# Altium project LimeSDR-XTRX_1v1.PrjPcb (part 2 of 5)

## Sheet 07_LMS7002M_Power.SchDoc: LMS7002M power
size A3; Organization: Lime Microsystems; Address1: Surrey Tech Centre; Address2: Guildford GU2 7YG; Address3: Surrey; Address4: United Kingdom; Revision: v1.1; SheetNumber: 7; SheetTotal: 10
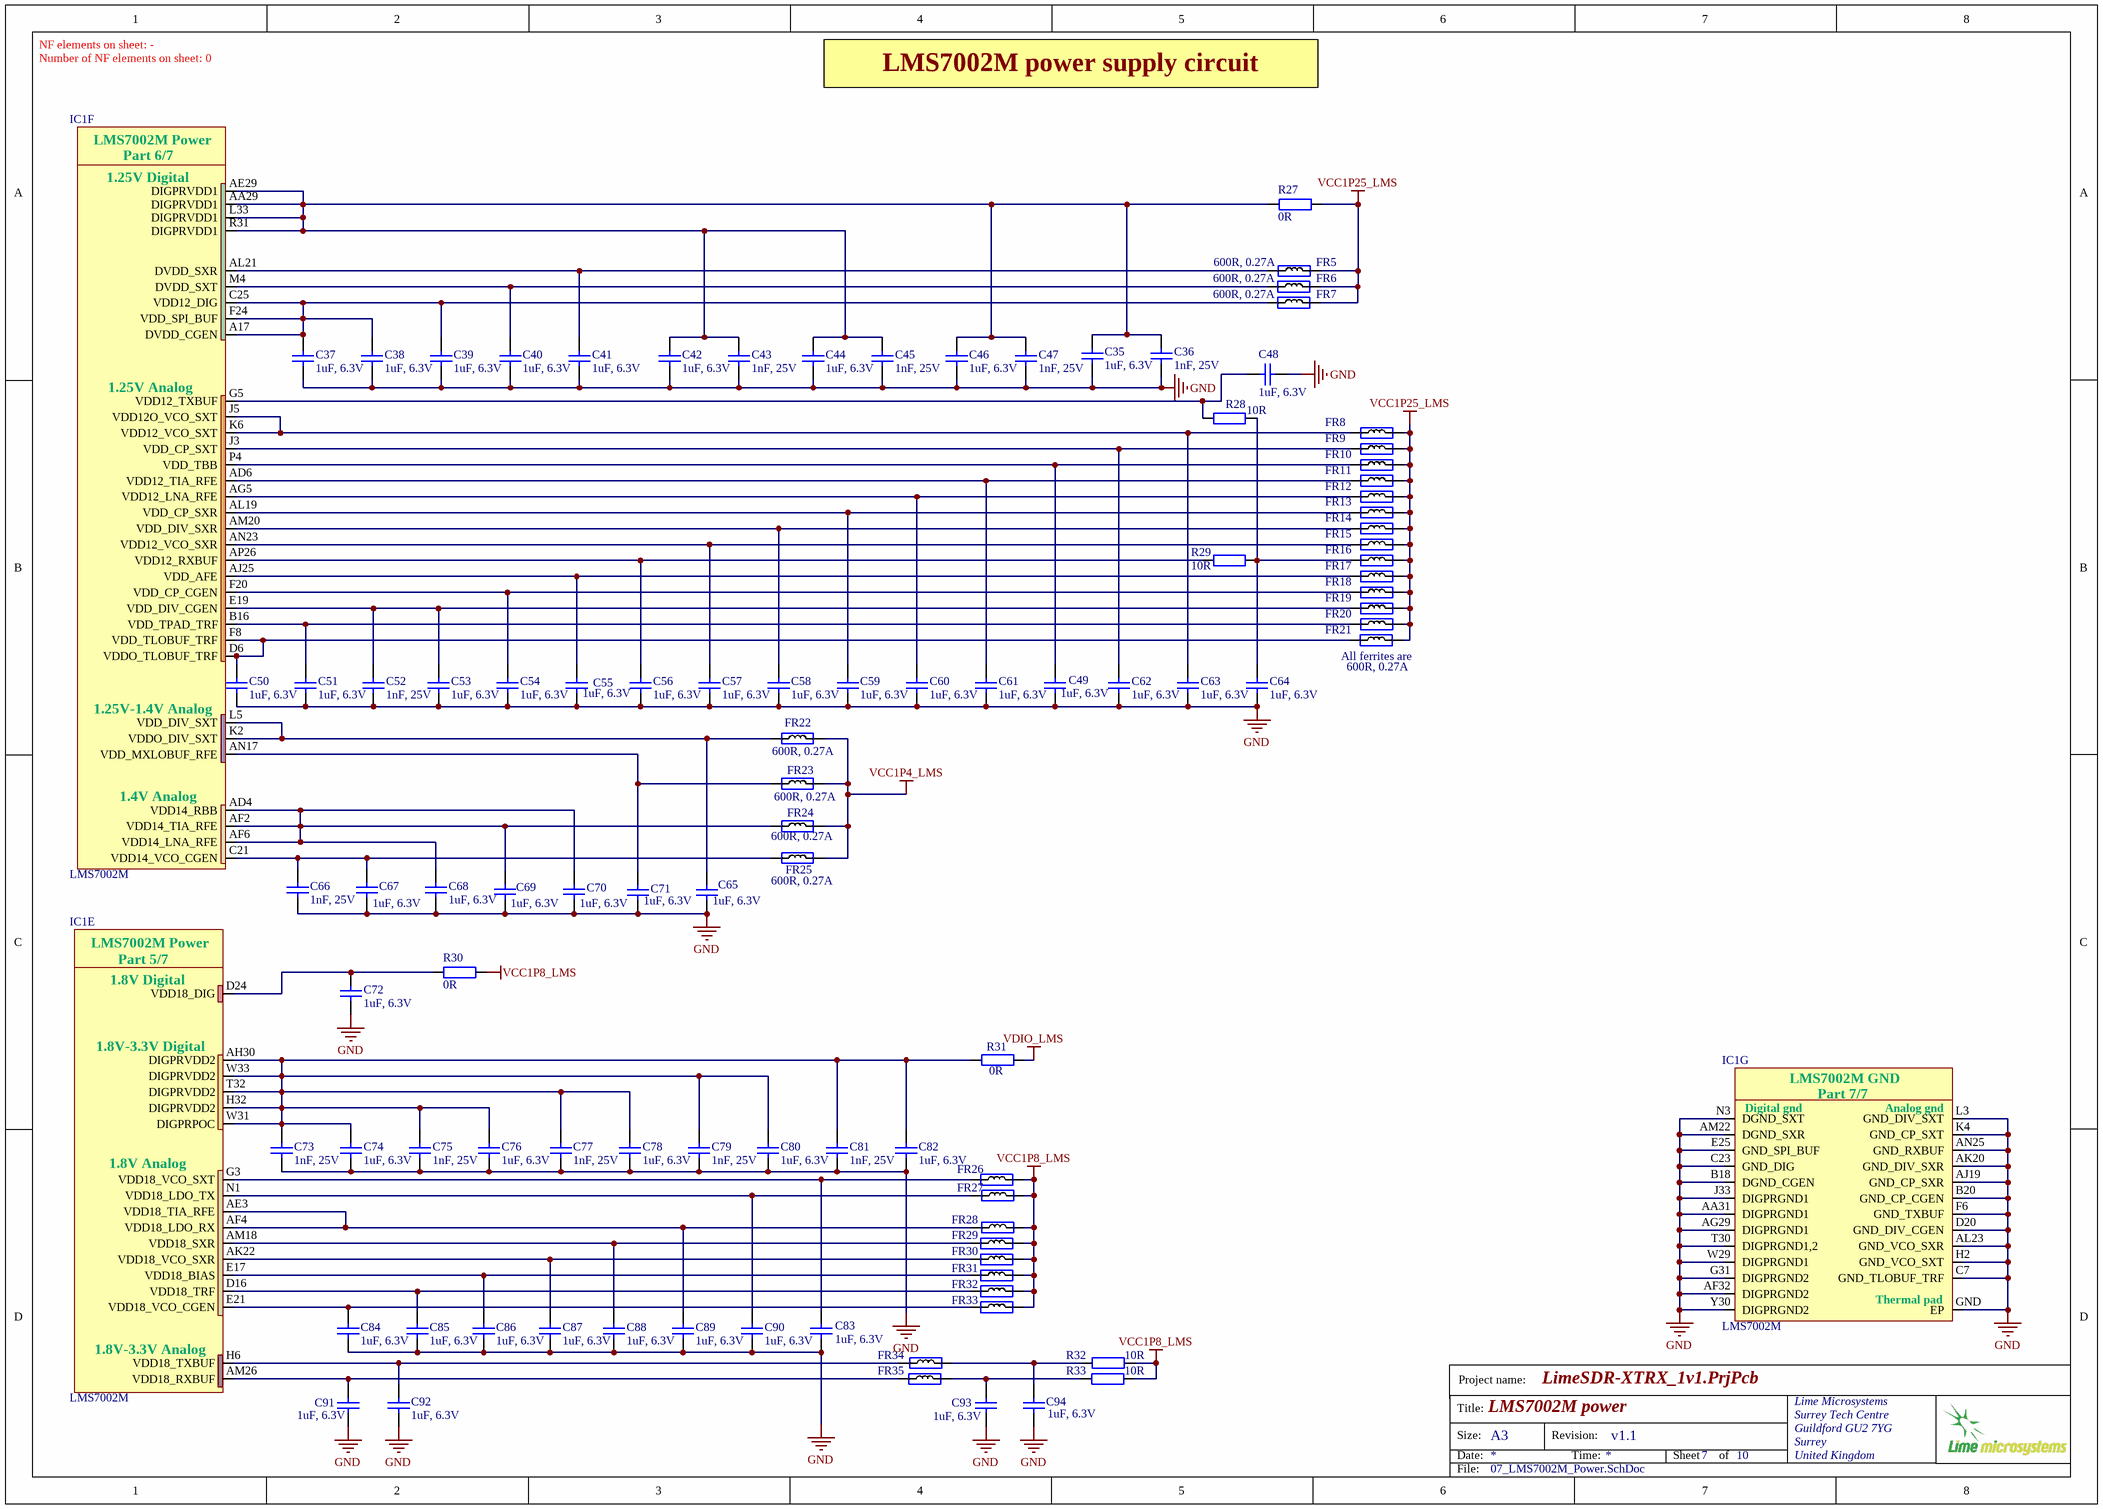
[diagram p4: 07_LMS7002M_Power.SchDoc]

### Parts
C35  1uF, 6.3V  [CAP0201]
C36  1nF, 25V  [CAP0201]
C37  1uF, 6.3V  [CAP0201]
C38  1uF, 6.3V  [CAP0201]
C39  1uF, 6.3V  [CAP0201]
C40  1uF, 6.3V  [CAP0201]
C41  1uF, 6.3V  [CAP0201]
C42  1uF, 6.3V  [CAP0201]
C43  1nF, 25V  [CAP0201]
C44  1uF, 6.3V  [CAP0201]
C45  1nF, 25V  [CAP0201]
C46  1uF, 6.3V  [CAP0201]
C47  1nF, 25V  [CAP0201]
C48  1uF, 6.3V  [CAP0201]
C49  1uF, 6.3V  [CAP0201]
C50  1uF, 6.3V  [CAP0201]
C51  1uF, 6.3V  [CAP0201]
C52  1nF, 25V  [CAP0201]
C53  1uF, 6.3V  [CAP0201]
C54  1uF, 6.3V  [CAP0201]
C55  1uF, 6.3V  [CAP0201]
C56  1uF, 6.3V  [CAP0201]
C57  1uF, 6.3V  [CAP0201]
C58  1uF, 6.3V  [CAP0201]
C59  1uF, 6.3V  [CAP0201]
C60  1uF, 6.3V  [CAP0201]
C61  1uF, 6.3V  [CAP0201]
C62  1uF, 6.3V  [CAP0201]
C63  1uF, 6.3V  [CAP0201]
C64  1uF, 6.3V  [CAP0201]
C65  1uF, 6.3V  [CAP0201]
C66  1nF, 25V  [CAP0201]
C67  1uF, 6.3V  [CAP0201]
C68  1uF, 6.3V  [CAP0201]
C69  1uF, 6.3V  [CAP0201]
C70  1uF, 6.3V  [CAP0201]
C71  1uF, 6.3V  [CAP0201]
C72  1uF, 6.3V  [CAP0201]
C73  1nF, 25V  [CAP0201]
C74  1uF, 6.3V  [CAP0201]
C75  1nF, 25V  [CAP0201]
C76  1uF, 6.3V  [CAP0201]
C77  1nF, 25V  [CAP0201]
C78  1uF, 6.3V  [CAP0201]
C79  1nF, 25V  [CAP0201]
C80  1uF, 6.3V  [CAP0201]
C81  1nF, 25V  [CAP0201]
C82  1uF, 6.3V  [CAP0201]
C83  1uF, 6.3V  [CAP0201]
C84  1uF, 6.3V  [CAP0201]
C85  1uF, 6.3V  [CAP0201]
C86  1uF, 6.3V  [CAP0201]
C87  1uF, 6.3V  [CAP0201]
C88  1uF, 6.3V  [CAP0201]
C89  1uF, 6.3V  [CAP0201]
C90  1uF, 6.3V  [CAP0201]
C91  1uF, 6.3V  [CAP0201]
C92  1uF, 6.3V  [CAP0201]
C93  1uF, 6.3V  [CAP0201]
C94  1uF, 6.3V  [CAP0201]
FR5  600R, 0.27A  [RES0201]
FR6  600R, 0.27A  [RES0201]
FR7  600R, 0.27A  [RES0201]
FR8  600R, 0.27A  [RES0201]
FR9  600R, 0.27A  [RES0201]  (value not drawn)
FR10  600R, 0.27A  [RES0201]  (value not drawn)
FR11  600R, 0.27A  [RES0201]  (value not drawn)
FR12  600R, 0.27A  [RES0201]  (value not drawn)
FR13  600R, 0.27A  [RES0201]  (value not drawn)
FR14  600R, 0.27A  [RES0201]  (value not drawn)
FR15  600R, 0.27A  [RES0201]  (value not drawn)
FR16  600R, 0.27A  [RES0201]  (value not drawn)
FR17  600R, 0.27A  [RES0201]  (value not drawn)
FR18  600R, 0.27A  [RES0201]  (value not drawn)
FR19  600R, 0.27A  [RES0201]  (value not drawn)
FR20  600R, 0.27A  [RES0201]  (value not drawn)
FR21  600R, 0.27A  [RES0201]  (value not drawn)
FR22  600R, 0.27A  [RES0201]
FR23  600R, 0.27A  [RES0201]
FR24  600R, 0.27A  [RES0201]
FR25  600R, 0.27A  [RES0201]
FR26  600R, 0.27A  [RES0201]  (value not drawn)
FR27  600R, 0.27A  [RES0201]  (value not drawn)
FR28  600R, 0.27A  [RES0201]  (value not drawn)
FR29  600R, 0.27A  [RES0201]  (value not drawn)
FR30  600R, 0.27A  [RES0201]  (value not drawn)
FR31  600R, 0.27A  [RES0201]  (value not drawn)
FR32  600R, 0.27A  [RES0201]  (value not drawn)
FR33  600R, 0.27A  [RES0201]  (value not drawn)
FR34  600R, 0.27A  [RES0201]  (value not drawn)
FR35  600R, 0.27A  [RES0201]  (value not drawn)
IC1  LMS7002M  [LMS7002M_v5_LESS_SILK]  (parts E,F,G of 7)
R27  0R  [RES0402]
R28  10R  [RES0201]
R29  10R  [RES0201]
R30  0R  [RES0201]
R31  0R  [RES0402]
R32  10R  [RES0201]
R33  10R  [RES0201]

### Nets
GND: C35.2 C36.2 C37.2 C38.2 C39.2 C40.1 C41.2 C42.2 C43.2 C44.2 C45.2 C46.2 C47.2 C48.2 C49.2 C50.2 C51.2 C52.2 C53.2 C54.1 C55.2 C56.2 C57.2 C58.2 C59.2 C60.2 C61.1 C62.2 C63.1 C64.1 C65.2 C66.2 C67.2 C68.2 C69.2 C70.2 C71.2 C72.2 C73.2 C74.2 C75.2 C76.2 C77.2 C78.2 C79.2 C80.2 C81.2 C82.2 C83.2 C84.2 C85.2 C86.2 C87.2 C88.2 C89.2 C90.2 C91.2 C92.2 C93.2 C94.2 IC1.AA31(DIGPRGND1) IC1.AF32(DIGPRGND2) IC1.AG29(DIGPRGND1) IC1.AJ19(GND_CP_SXR) IC1.AK20(GND_DIV_SXR) IC1.AL23(GND_VCO_SXR) IC1.AM22(DGND_SXR) IC1.AN25(GND_RXBUF) IC1.B18(DGND_CGEN) IC1.B20(GND_CP_CGEN) IC1.C7(GND_TLOBUF_TRF) IC1.C23(GND_DIG) IC1.D20(GND_DIV_CGEN) IC1.E25(GND_SPI_BUF) IC1.F6(GND_TXBUF) IC1.G31(DIGPRGND2) IC1.GND(EP) IC1.H2(GND_VCO_SXT) IC1.J33(DIGPRGND1) IC1.K4(GND_CP_SXT) IC1.L3(GND_DIV_SXT) IC1.N3(DGND_SXT) IC1.T30(DIGPRGND1,2) IC1.W29(DIGPRGND1) IC1.Y30(DIGPRGND2)
VCC1P4_LMS: FR22.2 FR23.2 FR24.2 FR25.2
VCC1P8_LMS: FR26.2 FR27.1 FR28.1 FR29.2 FR30.2 FR31.2 FR32.2 FR33.2 R30.2 R32.2 R33.1
VCC1P25_LMS: FR5.2 FR6.2 FR7.2 FR8.2 FR9.2 FR10.2 FR11.2 FR12.2 FR13.2 FR14.2 FR15.2 FR16.2 FR17.2 FR18.2 FR19.2 FR20.2 FR21.2 R27.1
VDIO_LMS: R31.1
NetC35_1: C35.1 C36.1 C42.1 C43.1 C44.1 C45.1 C46.1 C47.1 IC1.AA29(DIGPRVDD1) IC1.AE29(DIGPRVDD1) IC1.L33(DIGPRVDD1) IC1.R31(DIGPRVDD1) R27.2
NetC37_1: C37.1 C38.1 C39.1 FR7.1 IC1.A17(DVDD_CGEN) IC1.C25(VDD12_DIG) IC1.F24(VDD_SPI_BUF)
NetC40_2: C40.2 FR6.1 IC1.M4(DVDD_SXT)
NetC41_1: C41.1 FR5.1 IC1.AL21(DVDD_SXR)
NetC48_1: C48.1 IC1.G5(VDD12_TXBUF) R28.1
NetC49_1: C49.1 FR10.1 IC1.P4(VDD_TBB)
NetC50_1: C50.1 FR21.1 IC1.D6(VDDO_TLOBUF_TRF) IC1.F8(VDD_TLOBUF_TRF)
NetC51_1: C51.1 FR20.1 IC1.B16(VDD_TPAD_TRF)
NetC52_1: C52.1 C53.1 FR19.1 IC1.E19(VDD_DIV_CGEN)
NetC54_2: C54.2 FR18.1 IC1.F20(VDD_CP_CGEN)
NetC55_1: C55.1 FR17.1 IC1.AJ25(VDD_AFE)
NetC56_1: C56.1 IC1.AP26(VDD12_RXBUF) R29.1
NetC57_1: C57.1 FR15.1 IC1.AN23(VDD12_VCO_SXR)
NetC58_1: C58.1 FR14.1 IC1.AM20(VDD_DIV_SXR)
NetC59_1: C59.1 FR13.1 IC1.AL19(VDD_CP_SXR)
NetC60_1: C60.1 FR12.1 IC1.AG5(VDD12_LNA_RFE)
NetC61_2: C61.2 FR11.1 IC1.AD6(VDD12_TIA_RFE)
NetC62_1: C62.1 FR9.1 IC1.J3(VDD_CP_SXT)
NetC63_2: C63.2 FR8.1 IC1.J5(VDD12O_VCO_SXT) IC1.K6(VDD12_VCO_SXT)
NetC64_2: C64.2 FR16.1 R28.2 R29.2
NetC65_1: C65.1 FR22.1 IC1.K2(VDDO_DIV_SXT) IC1.L5(VDD_DIV_SXT)
NetC66_1: C66.1 C67.1 FR25.1 IC1.C21(VDD14_VCO_CGEN)
NetC68_1: C68.1 C69.1 C70.1 FR24.1 IC1.AD4(VDD14_RBB) IC1.AF2(VDD14_TIA_RFE) IC1.AF6(VDD14_LNA_RFE)
NetC71_1: C71.1 FR23.1 IC1.AN17(VDD_MXLOBUF_RFE)
NetC72_1: C72.1 IC1.D24(VDD18_DIG) R30.1
NetC73_1: C73.1 C74.1 C75.1 C76.1 C77.1 C78.1 C79.1 C80.1 C81.1 C82.1 IC1.AH30(DIGPRVDD2) IC1.H32(DIGPRVDD2) IC1.T32(DIGPRVDD2) IC1.W31(DIGPRPOC) IC1.W33(DIGPRVDD2) R31.2
NetC83_1: C83.1 FR26.1 IC1.G3(VDD18_VCO_SXT)
NetC84_1: C84.1 FR33.1 IC1.E21(VDD18_VCO_CGEN)
NetC85_1: C85.1 FR32.1 IC1.D16(VDD18_TRF)
NetC86_1: C86.1 FR31.1 IC1.E17(VDD18_BIAS)
NetC87_1: C87.1 FR30.1 IC1.AK22(VDD18_VCO_SXR)
NetC88_1: C88.1 FR29.1 IC1.AM18(VDD18_SXR)
NetC89_1: C89.1 FR28.2 IC1.AE3(VDD18_TIA_RFE) IC1.AF4(VDD18_LDO_RX)
NetC90_1: C90.1 FR27.2 IC1.N1(VDD18_LDO_TX)
NetC91_1: C91.1 FR35.1 IC1.AM26(VDD18_RXBUF)
NetC92_1: C92.1 FR34.2 IC1.H6(VDD18_TXBUF)
NetC93_1: C93.1 FR35.2 R33.2
NetC94_1: C94.1 FR34.1 R32.1

### Notes on the sheet
- NF elements on sheet: -
- Number of NF elements on sheet: 0
- LMS7002M power supply circuit
- (near FR21) All ferrites are
- Project name:
- Title:
- Size:
- Date:
- A3
- Revision:
- Time:
- Sheet
- of
- File:
- (in symbol LMS7002Mr4, part E) LMS7002M Power; Part 5/7; 1.8V Digital; 1.8V-3.3V Digital; 1.8V Analog; 1.8V-3.3V Analog
- (in symbol LMS7002Mr4, part F) LMS7002M Power; Part 6/7; 1.25V Digital; 1.25V Analog; 1.25V-1.4V Analog; 1.4V Analog
- (in symbol LMS7002Mr4, part G) LMS7002M GND; Part 7/7; Digital gnd; Analog gnd; Thermal pad

### Library data of the parts
C35 C37-C42 C44 C46 C48-C51 C53-C65 C67-C72 C74 C76 C78 C80 C82-C94 = Cap_0402: Manufacturer: TDK Corporation; Manufacturer Part Number 1: JMK063ABJ105MP-F; Part Description: 1µF ±20% 6.3V X5R Ceramic Capacitor -55°C ~ 85°C Surface Mount, MLCC 0201 (0603 Metric) 0.024" L x 0.012" W (0.60mm x 0.30mm); Value: 1uF, 20%; Tolerance: ±20%; Capacitance: 1.0µF; Temperature Coefficient: X5R; Supplier 1: Digi-Key; Supplier Part Number 1: 587-5864-2-ND; Applications: General Purpose; Features: -; Lead Style: -; Ratings: -; Thickness (Max): -; Lead Spacing: -; Height - Seated (Max): -; Size / Dimension: 0.024" L x 0.012" W (0.60mm x 0.30mm); Mounting Type: Surface Mount, MLCC; Operating Temperature: -55°C ~ 85°C; Package / Case: 0201 (0603 Metric); Packaging: Cut Tape (CT); Voltage - Rated: 6.3V; Category: Capacitors; RoHS: RoHS Compliant
C36 C43 C45 C47 C52 C66 C73 C75 C77 C79 C81 = Cap_0402: Manufacturer Part Number 1: C0603X7R1E102K030BA; Manufacturer: TDK Corporation; Part Description: 1000pF ±10% 25V X7R Ceramic Capacitor -55°C ~ 125°C Surface Mount, MLCC 0201 (0603 Metric) 0.024" L x 0.012" W (0.60mm x 0.30mm); Temperature Coefficient: X7R; Tolerance: ±10%; Capacitance: 1000pF; Value: 1nF, 25V; Supplier 1: Digi-Key; Supplier Part Number 1: 445-7275-1-ND; Voltage - Rated: 25V; Features: -; Package / Case: 0201 (0603 Metric); Lead Spacing: -; Mounting Type: Surface Mount, MLCC; Lead Style: -; Height - Seated (Max): -; Operating Temperature: -55°C ~ 125°C; Size / Dimension: 0.024" L x 0.012" W (0.60mm x 0.30mm); Applications: General Purpose; Ratings: -; Thickness (Max): 0.013" (0.33mm); RoHS: RoHS Compliant; Packaging: Cut Tape (CT); Category: Capacitors
FR5-FR35 = Ferrite: Manufacturer Part Number 1: BK0603TS601-T; Manufacturer: Taiyo Yuden; Part Description: FERRITE BEAD 600 OHM 0201 1LN; DC Resistance (DCR): 750 mOhm Max; Filter Type: Differential Mode - Single; Impedance @ Frequency: 600 Ohm @ 100MHz; Current Rating: 270mA; Value: 600R@100MHz; Supplier 1: Digi-Key; Supplier Part Number 1: 587-3277-1-ND; Size / Dimension: 0.024" L x 0.012" W (0.60mm x 0.30mm); Package / Case: 0201 (0603 Metric); Height (Max): 0.013" (0.33mm); Mounting Type: Surface Mount; Packaging: Cut Tape (CT); RoHS: RoHS Compliant; Category: Filters
IC1 = LMS7002Mr4: Schematic symbol revision 4. Default footprint - 0.31mm pad; Manufacturer: Lime Microsystems; Part Description: IC FPRF Transceiver LMS7002M; 261 pin aQFN; Supplier 1: Lime Microsystems; Supplier Part Number 1: LMS7002M; Manufacturer Part Number 1: LMS7002M
R27 R31 = Res_0402: Manufacturer Part Number 1: RC0402JR-070RL; Manufacturer: Yageo; Part Description: RES SMD 0.0OHM JUMPER 1/16W 0402; Resistance (Ohms): 0.0; Tolerance: Jumper; Power (Watts): 0.063W, 1/16W; Value: 0R; Supplier 1: Digi-Key; Supplier Part Number 1: 311-0.0JRTR-ND; Category: Resistors; Temperature Coefficient: -; Features: Moisture Resistant; Supplier Device Package: 0402; Height: 0.016" (0.40mm); Package / Case: 0402 (1005 Metric); Operating Temperature: -55°C ~ 155°C; Size / Dimension: 0.039" L x 0.020" W (1.00mm x 0.50mm); Composition: Thick Film; Packaging: Tape & Reel (TR); Number of Terminations: 2; RoHS: RoHS Compliant
R28 R29 R32 R33 = Res_0402: Manufacturer: Panasonic Electronic Components; Part Description: RES SMD 10 OHM 1% 1/20W 0201; Manufacturer Part Number 1: ERJ-1GEF10R0C; Power (Watts): 0.05W, 1/20W; Resistance (Ohms): 10; Tolerance: ±1%; Temperature Coefficient: ±200ppm/°C; Value: 10R; Supplier 1: Digi-Key; Supplier Part Number 1: P10.0ABCT-ND; Package / Case: 0201 (0603 Metric); Height: 0.010" (0.26mm); Supplier Device Package: 0201; Packaging: Cut Tape (CT); Composition: Thick Film; Category: Resistors; Number of Terminations: 2; Size / Dimension: 0.024" L x 0.012" W (0.60mm x 0.30mm); Operating Temperature: -55°C ~ 125°C; Features: -; RoHS: RoHS Compliant
R30 = Res_0402: Manufacturer: Yageo; Part Description: 0 Ohms Jumper Chip Resistor 0201 (0603 Metric) Moisture Resistant Thick Film; Manufacturer Part Number 1: RC0201JR-070RL; Tolerance: 5%; Max Power Dissipation: 50mW; Voltage Rating (DC): 25V; Value: 0R; Supplier 1: Digi-Key; Supplier Part Number 1: 311-0.0NCT-ND; Number of Terminations: 2; Height: 0.01inch; Features: Moisture Resistant; RoHS: Yes; Packaging: Tape and Reel; Case/Package: 0201; Case Code (Imperial): 0201; Case Code (Metric): 0603; ComponentLink1Description: http://www.yageo.com/documents/recent/PYu-RC_Group_51_RoHS_L_7.pdf; ComponentLink1URL: http://www.yageo.com/documents/recent/PYu-RC_Group_51_RoHS_L_7.pdf; ComponentLink2Description: https://datasheet.ciiva.com/7672/1563626-7672248.pdf?src-supplier=Element14; ComponentLink2URL: https://datasheet.ciiva.com/7672/1563626-7672248.pdf?src-supplier=Element14; ComponentLink3Description: https://datasheet.ciiva.com/7672/1563626-7672247.pdf?src-supplier=Element14; ComponentLink3URL: https://datasheet.ciiva.com/7672/1563626-7672247.pdf?src-supplier=Element14; ComponentLink4Description: https://datasheet.ciiva.com/7660/1421516-7660808.pdf?src-supplier=Element14; ComponentLink4URL: https://datasheet.ciiva.com/7660/1421516-7660808.pdf?src-supplier=Element14; ComponentLink5Description: https://datasheet.ciiva.com/46391/1421516-46391340.pdf?src-supplier=Element14; ComponentLink5URL: https://datasheet.ciiva.com/46391/1421516-46391340.pdf?src-supplier=Element14; Construction: Rectangular; Contact Plating: Tin,Matte; Depth: 0.3mm; Lead Free: Lead Free; Length: 0.024inch; Max Operating Temperature: 125°C; Military Standard: Not; Min Operating Temperature: -55°C; Package Quantity: 1; Power Rating: 50mW; Pricing 1: 1=0,10000, 10=0,03700, 25=0,02680, 50=0,02020, 100=0,01500, 250=0,01140, 500=0,00912, 1000=0,00672, 5000=0,00482 (USD); Radiation Hardening: No; Resistance: 0R; Resistance Tolerance: 5%; Resistor Type: Thick Film; RoHS Compliant: Yes; Series: RC; Size Code: 0201; Stock 1: 6252381; Termination: SMD/SMT; Voltage Rating: 25V; Weight: 6E-06oz; Width: 0.012inch

## Sheet 09_Misc.SchDoc: Misc
size A3; Organization: Lime Microsystems; Address1: Surrey Tech Centre; Address2: Guildford GU2 7YG; Address3: Surrey; Address4: United Kingdom; Revision: v1.1; SheetNumber: 10; SheetTotal: 10
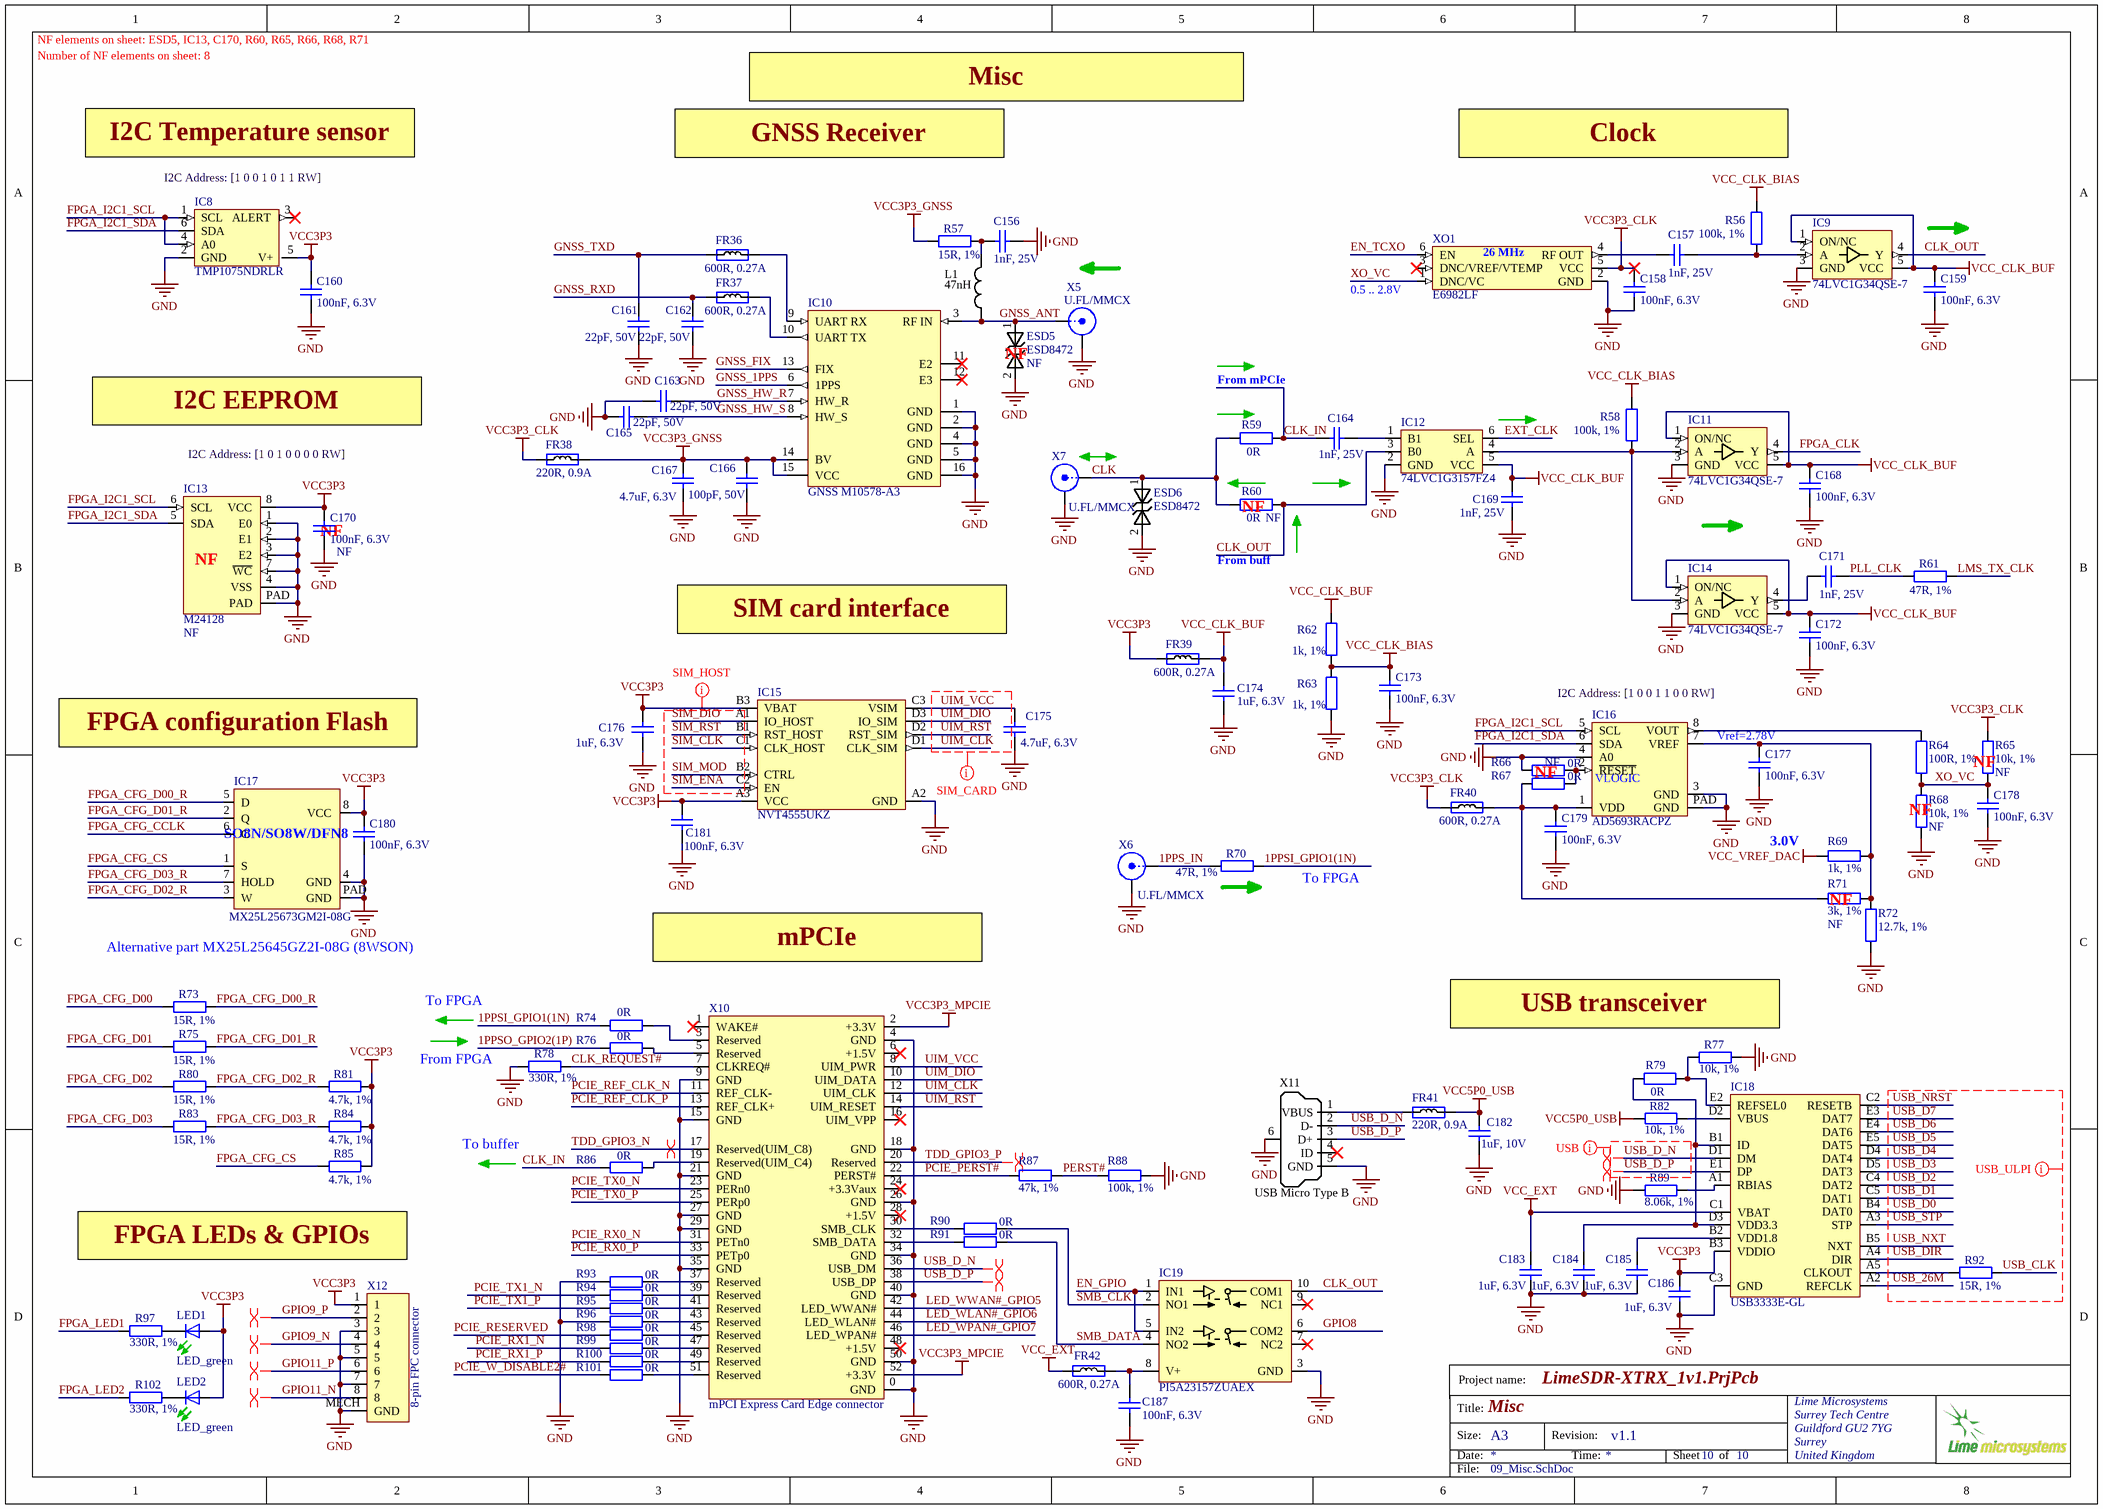
[diagram p5: 09_Misc.SchDoc]

### Parts
C156  1nF, 25V  [CAP0201]
C157  1nF, 25V  [CAP0201]
C158  100nF, 6.3V  [CAP0201]
C159  100nF, 6.3V  [CAP0201]
C160  100nF, 6.3V  [CAP0201]
C161  22pF, 50V  [CAP0201]
C162  22pF, 50V  [CAP0201]
C163  22pF, 50V  [CAP0201]
C164  1nF, 25V  [CAP0201]
C165  22pF, 50V  [CAP0201]
C166  100pF, 50V  [CAP0201]
C167  4.7uF, 6.3V  [CAP0402]
C168  100nF, 6.3V  [CAP0201]
C169  1nF, 25V  [CAP0201]
C170  100nF, 6.3V  Assembly Info: NF  [CAP0201]
C171  1nF, 25V  [CAP0201]
C172  100nF, 6.3V  [CAP0201]
C173  100nF, 6.3V  [CAP0201]
C174  1uF, 6.3V  [CAP0201]
C175  4.7uF, 6.3V  [CAP0402]
C176  1uF, 6.3V  [CAP0201]
C177  100nF, 6.3V  [CAP0201]
C178  100nF, 6.3V  [CAP0201]
C179  100nF, 6.3V  [CAP0201]
C180  100nF, 6.3V  [CAP0201]
C181  100nF, 6.3V  [CAP0201]
C182  1uF, 10V  [CAP0402]
C183  1uF, 6.3V  [CAP0201]
C184  1uF, 6.3V  [CAP0201]
C185  1uF, 6.3V  [CAP0201]
C186  1uF, 6.3V  [CAP0201]
C187  100nF, 6.3V  [CAP0201]
ESD5  ESD8472  Assembly Info: NF  [ESD8472_X3DFN2]
ESD6  ESD8472  [ESD8472_X3DFN2]
FR36  600R, 0.27A  [RES0201]
FR37  600R, 0.27A  [RES0201]
FR38  220R, 0.9A  [RES0402]
FR39  600R, 0.27A  [RES0201]
FR40  600R, 0.27A  [RES0201]
FR41  220R, 0.9A  [RES0402]
FR42  600R, 0.27A  [RES0201]
IC8  TMP1075NDRLR  [TMP1075NDRLR_temperature_sensor_SOT563]
IC9  74LVC1G34QSE-7  [74AHCT1G126SE-7_BUFFER_SOT353]
IC10  GNSS M10578-A3  [M10578-A3_v2]
IC11  74LVC1G34QSE-7  [74AHCT1G126SE-7_BUFFER_SOT353]
IC12  74LVC1G3157FZ4  [74LVC1G3157FZ4_SPDT_SW_DFN1410-6]
IC13  M24128  Assembly Info: NF  [M24128-DFMC6TG]
IC14  74LVC1G34QSE-7  [74AHCT1G126SE-7_BUFFER_SOT353]
IC15  NVT4555UKZ  [NVT4555UKZ_SIM_INTERFACE_WLCSP12]
IC16  AD5693RACPZ  [AD5693RACPZ-1RL7_DAC_8LFCSP]
IC17  MX25L25673GM2I-08G  [S25FL164K_WSON8_DFN6]
IC18  USB3333E-GL  [USB3333E-GL_USB_PHY_25WLCSP]
IC19  PI5A23157ZUAEX  [PI5A23157ZUAEX_SPDT_SW_10UQFN]
L1  47nH  [RES0402]
LED1  LED_green  [LED0201]
LED2  LED_green  [LED0201]
R56  100k, 1%  [RES0201]
R57  15R, 1%  [RES0201]
R58  100k, 1%  [RES0201]
R59  0R  [RES0201]
R60  0R  Assembly Info: NF  [RES0201]
R61  47R, 1%  [RES0201]
R62  1k, 1%  [RES0201]
R63  1k, 1%  [RES0201]
R64  100R, 1%  [RES0201]
R65  10k, 1%  Assembly Info: NF  [RES0201]
R66  0R  Assembly Info: NF  [RES0201]
R67  0R  [RES0201]
R68  10k, 1%  Assembly Info: NF  [RES0201]
R69  1k, 1%  [RES0201]
R70  47R, 1%  [RES0201]
R71  3k, 1%  Assembly Info: NF  [RES0201]
R72  12.7k, 1%  [RES0201]
R73  15R, 1%  [RES0201]
R74  0R  [RES0201]
R75  15R, 1%  [RES0201]
R76  0R  [RES0201]
R77  10k, 1%  [RES0201]
R78  330R, 1%  [RES0201]
R79  0R  [RES0201]
R80  15R, 1%  [RES0201]
R81  4.7k, 1%  [RES0201]
R82  10k, 1%  [RES0201]
R83  15R, 1%  [RES0201]
R84  4.7k, 1%  [RES0201]
R85  4.7k, 1%  [RES0201]
R86  0R  [RES0201]
R87  47k, 1%  [RES0201]
R88  100k, 1%  [RES0201]
R89  8.06k, 1%  [RES0201]
R90  0R  [RES0201]
R91  0R  [RES0201]
R92  15R, 1%  [RES0201]
R93  0R  [RES0201]
R94  0R  [RES0201]
R95  0R  [RES0201]
R96  0R  [RES0201]
R97  330R, 1%  [RES0201]
R98  0R  [RES0201]
R99  0R  [RES0201]
R100  0R  [RES0201]
R101  0R  [RES0201]
R102  330R, 1%  [RES0201]
X5  U.FL/MMCX  [MMCX_UFL_conn_u_v2]
X6  U.FL/MMCX  [MMCX_UFL_conn_u_v2]
X7  U.FL/MMCX  [MMCX_UFL_conn_u_v2]
X10  mPCI Express Card Edge connector  [PCIe_MiniCard]  (no BOM)
X11  USB Micro Type B  [USB_Micro_TypeB_47346-0001]
X12  8-pin FPC connector  [503480-0800_8PIN_FPC_CONN]
XO1  E6982LF  [RAKON_E8231LF_E6982LF]

### Nets
GND: C156.2 C158.2 C159.2 C160.2 C161.2 C162.2 C163.2 C165.2 C166.1 C167.1 C168.2 C169.1 C170.2 C172.2 C173.2 C174.2 C175.1 C176.2 C177.2 C178.2 C179.2 C180.2 C181.2 C182.1 C183.2 C184.2 C185.2 C186.2 C187.2 ESD5.2 ESD6.2 IC8.2(GND) IC9.3(GND) IC10.1(GND) IC10.2(GND) IC10.4(GND) IC10.5(GND) IC10.16(GND) IC11.3(GND) IC12.2(GND) IC13.1(E0) IC13.2(E1) IC13.3(E2) IC13.4(VSS) IC13.7(~{WC}) IC13.PAD IC14.3(GND) IC15.A2(GND) IC16.3(GND) IC16.4(A0) IC16.PAD(GND) IC17.4(GND) IC17.PAD(GND) IC18.C3(GND) IC19.3(GND) R63.2 R66.1 R68.2 R72.2 R77.1 R78.2 R88.1 R89.2 R93.1 R96.1 X5.2(Y) X6.2(Y) X7.2(Y) X10.0(GND) X10.4(GND) X10.9(GND) X10.15(GND) X10.18(GND) X10.21(GND) X10.26(GND) X10.27(GND) X10.29(GND) X10.34(GND) X10.35(GND) X10.40(GND) X10.50(GND) X11.5(GND) X11.6(Shell) X12.3 X12.5 X12.7 X12.MECH(GND) XO1.2(GND)
VCC3P3: C160.1 C170.1 C176.1 C180.1 C181.1 C186.1 FR39.1 IC8.5(V+) IC13.8(VCC) IC15.A3(VCC) IC15.B3(VBAT) IC17.8(VCC) IC18.B3(VDDIO) LED1.A LED2.A R81.1 R84.1 R85.1 X12.1
VCC3P3_CLK: C158.1 FR38.1 FR40.1 R65.1 XO1.5(VCC)
VCC3P3_GNSS: C166.2 C167.2 FR38.2 IC10.14(BV) IC10.15(VCC) R57.2
VCC3P3_MPCIE: X10.2(+3.3V) X10.52(+3.3V)
VCC5P0_USB: C182.2 FR41.2 R82.2
VCC_CLK_BIAS: C173.1 R56.2 R58.2 R62.2 R63.1
VCC_CLK_BUF: C159.1 C168.1 C169.2 C172.1 C174.1 FR39.2 IC9.1(ON/NC) IC9.5(VCC) IC11.1(ON/NC) IC11.5(VCC) IC12.5(VCC) IC14.1(ON/NC) IC14.5(VCC) R62.1
VCC_EXT: C183.1 FR42.1 IC18.C1(VBAT)
VCC_VREF_DAC: R69.2
1PPS_IN: R70.2 X6.1(X)
1PPSI_GPIO1(1N): R70.1 R74.1
1PPSO_GPIO2(1P): R76.1
CLK: ESD6.1 R59.1 R60.1 X7.1(X)
CLK_IN: C164.1 R59.2 R86.1
CLK_OUT: IC9.4(Y) IC12.3(B0) IC19.10(COM1) R60.2
CLK_REQUEST#: R78.1 X10.7(CLKREQ#)
EN_GPIO: IC19.1(IN1) IC19.5(IN2)
EN_TCXO: XO1.6(EN)
EXT_CLK: IC12.6(SEL)
FPGA_CFG_CCLK: IC17.6(C)
FPGA_CFG_CS: IC17.1(S) R85.2
FPGA_CFG_D00: R73.2
FPGA_CFG_D00_R: IC17.5(D) R73.1
FPGA_CFG_D01: R75.2
FPGA_CFG_D01_R: IC17.2(Q) R75.1
FPGA_CFG_D02: R80.2
FPGA_CFG_D02_R: IC17.3(W) R80.1 R81.2
FPGA_CFG_D03: R83.2
FPGA_CFG_D03_R: IC17.7(HOLD) R83.1 R84.2
FPGA_CLK: IC11.4(Y)
FPGA_I2C1_SCL: IC8.1(SCL) IC8.4(A0) IC13.6(SCL) IC16.5(SCL)
FPGA_I2C1_SDA: IC8.6(SDA) IC13.5(SDA) IC16.6(SDA)
FPGA_LED1: R97.2
FPGA_LED2: R102.2
GNSS_1PPS: IC10.6(1PPS)
GNSS_ANT: ESD5.1 IC10.3(RF_IN) L1.1 X5.1(X)
GNSS_FIX: IC10.13(FIX)
GNSS_HW_R: C163.1 IC10.7(HW_R)
GNSS_HW_S: C165.1 IC10.8(HW_S)
GNSS_RXD: C162.1 FR37.1
GNSS_TXD: C161.1 FR36.1
GPIO8: IC19.6(COM2)
GPIO9_N: X12.4
GPIO9_P: X12.2
GPIO11_N: X12.8
GPIO11_P: X12.6
LED_WLAN#_GPIO6: X10.44(LED_WLAN#)
LED_WPAN#_GPIO7: X10.46(LED_WPAN#)
LED_WWAN#_GPIO5: X10.42(LED_WWAN#)
LMS_TX_CLK: R61.1
PCIE_PERST#: R87.1 X10.22(PERST#)
PCIE_REF_CLK_N: X10.11(REF_CLK-)
PCIE_REF_CLK_P: X10.13(REF_CLK+)
PCIE_RESERVED: R98.1
PCIE_RX0_N: X10.31(PETn0)
PCIE_RX0_P: X10.33(PETp0)
PCIE_RX1_N: R99.1
PCIE_RX1_P: R100.1
PCIE_TX0_N: X10.23(PERn0)
PCIE_TX0_P: X10.25(PERp0)
PCIE_TX1_N: R94.1
PCIE_TX1_P: R95.1
PCIE_W_DISABLE2#: R101.1
PERST#: R87.2 R88.2
PLL_CLK: C171.2 R61.2
SIM_CLK: IC15.C1(CLK_HOST)
SIM_DIO: IC15.A1(IO_HOST)
SIM_ENA: IC15.C2(EN)
SIM_MOD: IC15.B2(CTRL)
SIM_RST: IC15.B1(RST_HOST)
SMB_CLK: IC19.2(NO1) R90.2
SMB_DATA: IC19.4(NO2) R91.2
TDD_GPIO3_N: X10.17(Reserved(UIM_C8))
TDD_GPIO3_P: X10.20(Reserved)
UIM_CLK: IC15.D1(CLK_SIM) X10.12(UIM_CLK)
UIM_DIO: IC15.D3(IO_SIM) X10.10(UIM_DATA)
UIM_RST: IC15.D2(RST_SIM) X10.14(UIM_RESET)
UIM_VCC: C175.2 IC15.C3(VSIM) X10.8(UIM_PWR)
USB_26M: IC18.A2(REFCLK)
USB_CLK: R92.1
USB_D0: IC18.B4(DAT0)
USB_D1: IC18.C5(DAT1)
USB_D2: IC18.C4(DAT2)
USB_D3: IC18.D5(DAT3)
USB_D4: IC18.D4(DAT4)
USB_D5: IC18.E5(DAT5)
USB_D6: IC18.E4(DAT6)
USB_D7: IC18.E3(DAT7)
USB_D_N: IC18.D1(DM) X10.36(USB_DM) X11.2(D-)
USB_D_P: IC18.E1(DP) X10.38(USB_DP) X11.3(D+)
USB_DIR: IC18.A4(DIR)
USB_NRST: IC18.C2(RESETB)
USB_NXT: IC18.B5(NXT)
USB_STP: IC18.A3(STP)
XO_VC: C178.1 R64.2 R65.2 R68.1 XO1.1(DNC/VC)
NetC156_1: C156.1 L1.2 R57.1
NetC157_1: C157.1 XO1.4(RF_OUT)
NetC157_2: C157.2 IC9.2(A) R56.1
NetC164_2: C164.2 IC12.1(B1)
NetC171_1: C171.1 IC14.4(Y)
NetC177_1: C177.1 IC16.7(VREF) R69.1 R71.1 R72.1
NetC179_1: C179.1 FR40.2 IC16.1(VDD) R67.1 R71.2
NetC184_1: C184.1 IC18.B1(ID) IC18.D3(VDD3.3) R79.1
NetC185_1: C185.1 IC18.B2(VDD1.8)
NetC187_1: C187.1 FR42.2 IC19.8(V+)
NetFR36_2: FR36.2 IC10.9(UART_RX)
NetFR37_2: FR37.2 IC10.10(UART_TX)
NetFR41_1: FR41.1 X11.1(VBUS)
NetIC11_2: IC11.2(A) IC12.4(A) IC14.2(A) R58.1
NetIC16_2: IC16.2(~{RESET}) R66.2 R67.2
NetIC16_8: IC16.8(VOUT) R64.1
NetIC18_A1: IC18.A1(RBIAS) R89.1
NetIC18_A5: IC18.A5(CLKOUT) R92.2
NetIC18_D2: IC18.D2(VBUS) R82.1
NetIC18_E2: IC18.E2(REFSEL0) R77.2 R79.2
NetLED1_K: LED1.K(C) R97.1
NetLED2_K: LED2.K(C) R102.1
NetR74_2: R74.2 X10.3(Reserved)
NetR76_2: R76.2 X10.5(Reserved)
NetR86_2: R86.2 X10.19(Reserved(UIM_C4))
NetR90_1: R90.1 X10.30(SMB_CLK)
NetR91_1: R91.1 X10.32(SMB_DATA)
NetR93_2: R93.2 X10.37(Reserved)
NetR94_2: R94.2 X10.39(Reserved)
NetR95_2: R95.2 X10.41(Reserved)
NetR96_2: R96.2 X10.43(Reserved)
NetR98_2: R98.2 X10.45(Reserved)
NetR99_2: R99.2 X10.47(Reserved)
NetR100_2: R100.2 X10.49(Reserved)
NetR101_2: R101.2 X10.51(Reserved)

Not connected (* = marked no-connect by the designer): IC8 3(ALERT)*; IC10 11(E2)* 12(E3)*; IC19 7(NC2)* 9(NC1)*; X10 1(WAKE#)* 6(+1.5V)* 16(UIM_VPP)* 24(+3.3Vaux)* 28(+1.5V)* 48(+1.5V)*; X11 4(ID)*; XO1 3(DNC/VREF/VTEMP)*

### Layout directives
net class SIM_HOST: SIM_CLK, SIM_DIO, SIM_ENA, SIM_MOD, SIM_RST
net class SIM_CARD: UIM_CLK, UIM_DIO, UIM_RST, UIM_VCC
differential pair: GPIO9_N, GPIO9_P, GPIO11_N, GPIO11_P, TDD_GPIO3_N, TDD_GPIO3_P, USB_D_N, USB_D_P
net class USB: USB_D_N, USB_D_P
net class USB_ULPI: USB_26M, USB_CLK, USB_D0, USB_D1, USB_D2, USB_D3, USB_D4, USB_D5, USB_D6, USB_D7, USB_DIR, USB_NRST, USB_NXT, USB_STP

### Notes on the sheet
- NF elements on sheet: ESD5, IC13, C170, R60, R65, R66, R68, R71
- Number of NF elements on sheet: 8
- Misc
- I2C Temperature sensor
- (near IC8) I2C Address: [1 0 0 1 0 1 1 RW]
- GNSS Receiver
- Clock
- (near XO1) 26 MHz
- (near ESD5) NF
- From mPCIe
- (near XO1) 0.5 .. 2.8V
- I2C EEPROM
- I2C Address: [1 0 1 0 0 0 0 RW]
- (near R60) NF
- (near IC13) NF
- (near C170) NF
- (near R60) From buff
- SIM card interface
- (near IC16) I2C Address: [1 0 0 1 1 0 0 RW]
- FPGA configuration Flash
- NF
- (near IC16) VLOGIC
- (near C177) Vref=2.78V
- (near R65) NF
- (near R69) 3.0V
- (near R68) NF
- (near R70) To FPGA
- (near R71) NF
- Alternative part MX25L25645GZ2I-08G (8WSON)
- mPCIe
- To FPGA
- (near R77) USB transceiver
- From FPGA
- To buffer
- FPGA LEDs & GPIOs
- Project name:
- Title:
- Size:
- Date:
- A3
- Revision:
- Time:
- Sheet
- of
- File:
- (in symbol M25P40_with_pad) SO8N/SO8W/DFN8